# Altium project SAP18.PrjPcb
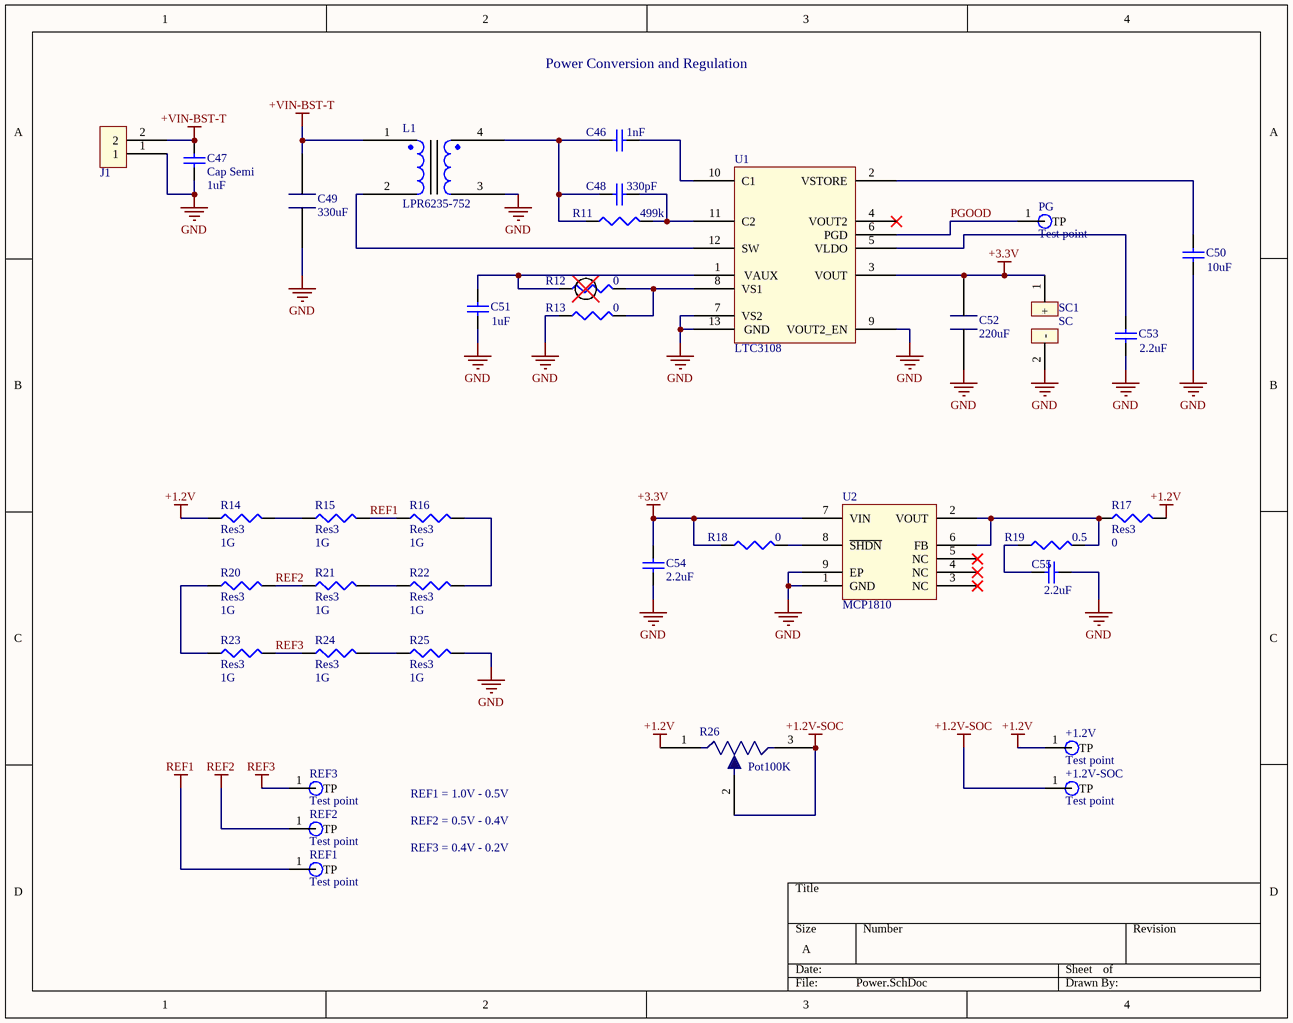
[diagram p0: Power.SchDoc]
8 sheets, 141 parts. Net scope: global (net labels, ports and power ports of the same name join across sheets).
Board file: SAP18.PcbDoc
Sheets:
  Power.SchDoc
  SoC18.SchDoc
  PMU.SchDoc
  Caps.SchDoc
  PwrSel.SchDoc
  Digital.SchDoc
  Analog.SchDoc
  Adapter.SchDoc

## Sheet Power.SchDoc
size A

### Parts
+1.2V  Test point  [TP]
+1.2V-SOC  Test point  [TP]
C46  value 1nF  [0402]  (hidden comment: Cap Semi)
C47  Cap Semi  value 1uF  [0402]
C48  value 330pF  [0402]  (hidden comment: Cap Semi)
C49  330uF  [CAPCP7343X43NEW]
C50  value 10uF  [0402]  (hidden comment: Cap Semi)
C51  value 1uF  [0402]  (hidden comment: Cap Semi)
C52  220uF  [CAPCP7343X43NEW]
C53  value 2.2uF  [0402]  (hidden comment: Cap Semi)
C54  value 2.2uF  [0402]  (hidden comment: Cap Semi)
C55  value 2.2uF  [0402]  (hidden comment: Cap Semi)
J1  MolexPicoLock  [5037630291_MolexPicoLock]  (value not drawn)
L1  LPR6235-752  [LPR6235-752]
PG  Test point  [TP]
R11  value 499k  [0402]  (hidden comment: Res3)
R12  value 0  [0402]  (hidden comment: Res3)
R13  value 0  [0402]  (hidden comment: Res3)
R14  Res3  value 1G  [6-0805_N]
R15  Res3  value 1G  [6-0805_N]
R16  Res3  value 1G  [6-0805_N]
R17  Res3  value 0  [0402]
R18  value 0  [0402]  (hidden comment: Res3)
R19  value 0.5  [0402]  (hidden comment: Res3)
R20  Res3  value 1G  [6-0805_N]
R21  Res3  value 1G  [6-0805_N]
R22  Res3  value 1G  [6-0805_N]
R23  Res3  value 1G  [6-0805_N]
R24  Res3  value 1G  [6-0805_N]
R25  Res3  value 1G  [6-0805_N]
R26  Pot100K  [Pot100K]
REF1  Test point  [TP]
REF2  Test point  [TP]
REF3  Test point  [TP]
SC1  SC  [SocketBattCR2032]
U1  LTC3108  [QFN0P300X400X80_HS-13M]
U2  MCP1810  [MCP1810]

### Nets
+1.2V: +1.2V.1(TP) R14.1 R17.2 R26.1
+1.2V-SOC: +1.2V-SOC.1(TP) R26.2 R26.3  [project net VCAP_STUP]
+3.3V: C52.1 C54.2 R18.1 SC1.1(+) U1.3(VOUT) U2.7(VIN)
+VIN-BST-T: C47.1 C49.1 J1.2 L1.1
GND: C47.2 C49.2 C50.1 C51.1 C52.2 C53.1 C54.1 C55.1 J1.1 L1.3 R13.1 R25.2 SC1.2(-) U1.7(VS2) U1.9(VOUT2_EN) U1.13(GND) U2.1(GND) U2.9(EP)
REF1: R15.2 R16.1 REF1.1(TP)
REF2: R20.2 R21.1 REF2.1(TP)
REF3: R23.2 R24.1 REF3.1(TP)
PGOOD: PG.1(TP) U1.6(PGD)
NetC46_1: C46.1 C48.1 L1.4 R11.1
NetC46_2: C46.2 U1.10(C1)
NetC48_2: C48.2 R11.2 U1.11(C2)
NetC50_2: C50.2 U1.2(VSTORE)
NetC51_2: C51.2 R12.1 U1.1(VAUX)
NetC53_2: C53.2 U1.5(VLDO)
NetC55_2: C55.2 R19.1
NetL1_2: L1.2 U1.12(SW)
NetR12_2: R12.2 R13.2 U1.8(VS1)
NetR14_2: R14.2 R15.1
NetR16_2: R16.2 R22.2
NetR17_1: R17.1 R19.2 U2.2(VOUT) U2.6(FB)
NetR18_2: R18.2 U2.8(~{SHDN})
NetR20_1: R20.1 R23.1
NetR21_2: R21.2 R22.1
NetR24_2: R24.2 R25.1

Not connected (* = marked no-connect by the designer): U1 4(VOUT2)*; U2 3(NC)* 4(NC)* 5(NC)*

### Notes on the sheet
- Power Conversion and Regulation
- REF1 = 1.0V - 0.5V
- REF2 = 0.5V - 0.4V
- REF3 = 0.4V - 0.2V

### Library data of the parts
C46-C48 C50 C51 C53-C55 = Cap Semi: Capacitor (Semiconductor SIM Model); Published: 8-Jun-2000; LatestRevisionDate: 29-May-2009; LatestRevisionNote: IPC-7351 Footprint Added.; PackageReference: C1206; Publisher: Altium Limited; PackageDescription: Chip Capacitor
C49 C52 = BoostCap
J1 = MolexPicoLock: Molex Pico Lock 2 pin
R11-R25 = Res3: Resistor; Published: 8-Jun-2000; LatestRevisionDate: 29-May-2009; LatestRevisionNote: IPC-7351 Footprint Added.; PackageReference: J1-0603; Publisher: Altium Limited; PackageDescription: Chip Resistor
R26 = Pot100K: EVM-2WSX80B15 100K Trimpot SMD
SC1 = Soket Battery CR2032: Socket Battery CR2032
U2 = MCP1810: Ultra-low Power LDO

## Sheet SoC18.SchDoc
size A
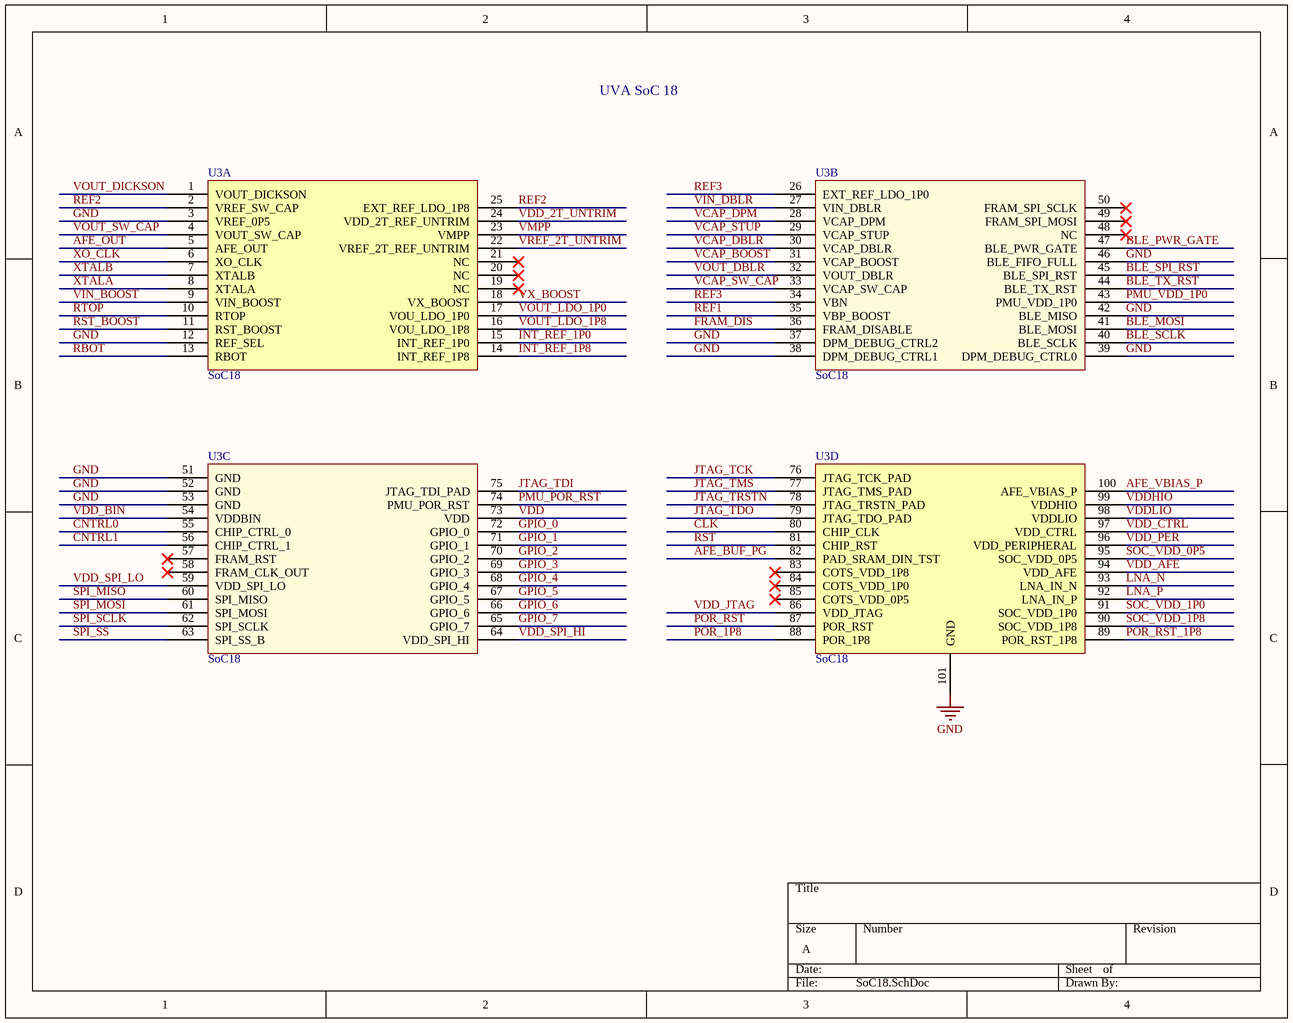
[diagram p1: SoC18.SchDoc]

### Parts
U3  SoC18  [MLF_7009 - NoHoles]  (parts A,B,C,D of 4)

### Nets
AFE_BUF_PG: U3.82(PAD_SRAM_DIN_TST)
FRAM_DIS: U3.36(FRAM_DISABLE)
GND: U3.3(VREF_0P5) U3.12(REF_SEL) U3.28(VCAP_DPM) U3.37(DPM_DEBUG_CTRL2) U3.38(DPM_DEBUG_CTRL1) U3.39(DPM_DEBUG_CTRL0) U3.42(BLE_MISO) U3.46(BLE_FIFO_FULL) U3.51(GND) U3.52(GND) U3.53(GND) U3.101(GND)  [also labelled VCAP_DPM]
PMU_POR_RST: U3.74(PMU_POR_RST)
REF1: U3.35(VBP_BOOST)
REF2: U3.2(VREF_SW_CAP) U3.25(EXT_REF_LDO_1P8)
REF3: U3.26(EXT_REF_LDO_1P0) U3.34(VBN)
SOC_VDD_0P5: U3.95(SOC_VDD_0P5)
SOC_VDD_1P0: U3.91(SOC_VDD_1P0)
SOC_VDD_1P8: U3.90(SOC_VDD_1P8)
VCAP_STUP: U3.29(VCAP_STUP)
VDD: U3.73(VDD)
VDD_AFE: U3.94(VDD_AFE)
VDD_BIN: U3.54(VDDBIN)
VDD_CTRL: U3.97(VDD_CTRL)
VDD_JTAG: U3.86(VDD_JTAG)
VDD_PER: U3.96(VDD_PERIPHERAL)
VDD_SPI_HI: U3.64(VDD_SPI_HI)
VDD_SPI_LO: U3.59(VDD_SPI_LO)
VDDHIO: U3.99(VDDHIO)
VDDLIO: U3.98(VDDLIO)
VOUT_DICKSON: U3.1(VOUT_DICKSON)
AFE_OUT: U3.5(AFE_OUT)
AFE_VBIAS_P: U3.100(AFE_VBIAS_P)
BLE_MOSI: U3.41(BLE_MOSI)
BLE_PWR_GATE: U3.47(BLE_PWR_GATE)
BLE_SCLK: U3.40(BLE_SCLK)
BLE_SPI_RST: U3.45(BLE_SPI_RST)
BLE_TX_RST: U3.44(BLE_TX_RST)
CLK: U3.80(CHIP_CLK)
CNTRL0: U3.55(CHIP_CTRL_0)
CNTRL1: U3.56(CHIP_CTRL_1)
GPIO_0: U3.72(GPIO_0)
GPIO_1: U3.71(GPIO_1)
GPIO_2: U3.70(GPIO_2)
GPIO_3: U3.69(GPIO_3)
GPIO_4: U3.68(GPIO_4)
GPIO_5: U3.67(GPIO_5)
GPIO_6: U3.66(GPIO_6)
GPIO_7: U3.65(GPIO_7)
INT_REF_1P0: U3.15(INT_REF_1P0)
INT_REF_1P8: U3.14(INT_REF_1P8)
JTAG_TCK: U3.76(JTAG_TCK_PAD)
JTAG_TDI: U3.75(JTAG_TDI_PAD)
JTAG_TDO: U3.79(JTAG_TDO_PAD)
JTAG_TMS: U3.77(JTAG_TMS_PAD)
JTAG_TRSTN: U3.78(JTAG_TRSTN_PAD)
LNA_N: U3.93(LNA_IN_N)
LNA_P: U3.92(LNA_IN_P)
PMU_VDD_1P0: U3.43(PMU_VDD_1P0)
POR_1P8: U3.88(POR_1P8)
POR_RST: U3.87(POR_RST)
POR_RST_1P8: U3.89(POR_RST_1P8)
RBOT: U3.13(RBOT)
RST: U3.81(CHIP_RST)
RST_BOOST: U3.11(RST_BOOST)
RTOP: U3.10(RTOP)
SPI_MISO: U3.60(SPI_MISO)
SPI_MOSI: U3.61(SPI_MOSI)
SPI_SCLK: U3.62(SPI_SCLK)
SPI_SS: U3.63(SPI_SS_B)
VCAP_BOOST: U3.31(VCAP_BOOST)
VCAP_DBLR: U3.30(VCAP_DBLR)
VCAP_SW_CAP: U3.33(VCAP_SW_CAP)
VDD_2T_UNTRIM: U3.24(VDD_2T_REF_UNTRIM)
VIN_BOOST: U3.9(VIN_BOOST)
VIN_DBLR: U3.27(VIN_DBLR)
VMPP: U3.23(VMPP)
VOUT_DBLR: U3.32(VOUT_DBLR)
VOUT_LDO_1P0: U3.17(VOU_LDO_1P0)
VOUT_LDO_1P8: U3.16(VOU_LDO_1P8)
VOUT_SW_CAP: U3.4(VOUT_SW_CAP)
VREF_2T_UNTRIM: U3.22(VREF_2T_REF_UNTRIM)
VX_BOOST: U3.18(VX_BOOST)
XO_CLK: U3.6(XO_CLK)
XTALA: U3.8(XTALA)
XTALB: U3.7(XTALB)

Not connected (* = marked no-connect by the designer): U3 19(NC)* 20(NC)* 21(NC)* 48(NC)* 49(FRAM_SPI_MOSI)* 50(FRAM_SPI_SCLK)* 57(FRAM_RST)* 58(FRAM_CLK_OUT)* 83(COTS_VDD_1P8)* 84(COTS_VDD_1P0)* 85(COTS_VDD_0P5)*

### Notes on the sheet
- UVA SoC 18

### Library data of the parts
U3 = SoC18: UVA SoC ASSIST 2018

## Sheet PMU.SchDoc
size A
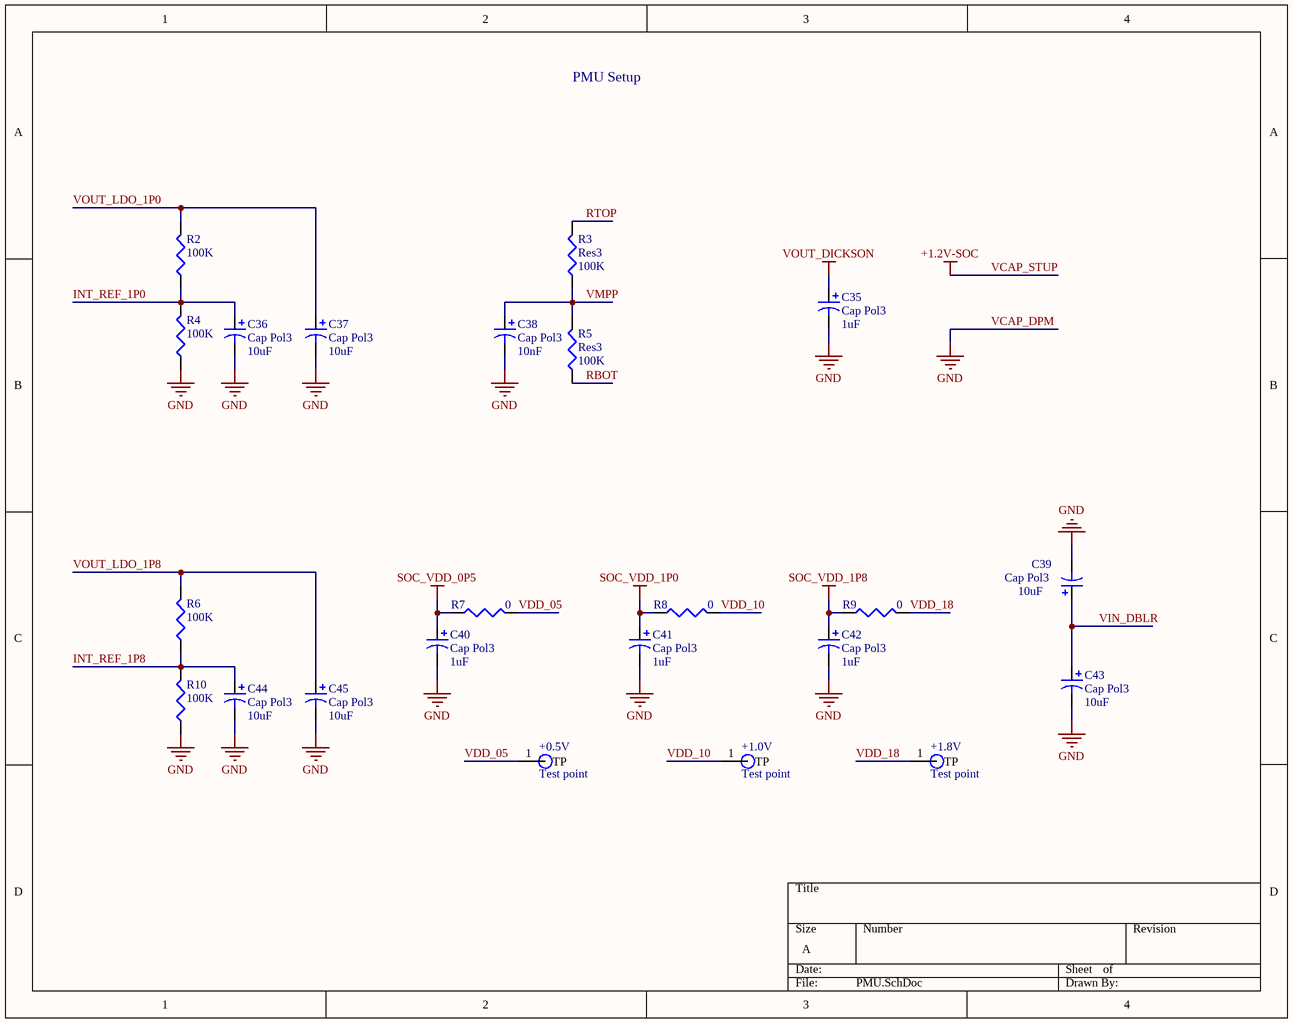
[diagram p2: PMU.SchDoc]

### Parts
+0.5V  Test point  [TP]
+1.0V  Test point  [TP]
+1.8V  Test point  [TP]
C35  Cap Pol3  value 1uF  [0402]
C36  Cap Pol3  value 10uF  [0402]
C37  Cap Pol3  value 10uF  [0402]
C38  Cap Pol3  value 10nF  [0402]
C39  Cap Pol3  value 10uF  [0402]
C40  Cap Pol3  value 1uF  [0402]
C41  Cap Pol3  value 1uF  [0402]
C42  Cap Pol3  value 1uF  [0402]
C43  Cap Pol3  value 10uF  [0402]
C44  Cap Pol3  value 10uF  [0402]
C45  Cap Pol3  value 10uF  [0402]
R2  value 100K  [0402]  (hidden comment: Res3)
R3  Res3  value 100K  [0402]
R4  value 100K  [0402]  (hidden comment: Res3)
R5  Res3  value 100K  [0402]
R6  value 100K  [0402]  (hidden comment: Res3)
R7  value 0  [0402]  (hidden comment: Res3)
R8  value 0  [0402]  (hidden comment: Res3)
R9  value 0  [0402]  (hidden comment: Res3)
R10  value 100K  [0402]  (hidden comment: Res3)

### Nets
GND: C35.2 C36.2 C37.2 C38.2 C39.2 C40.2 C41.2 C42.2 C43.2 C44.2 C45.2 R4.1 R10.1  [also labelled VCAP_DPM]
SOC_VDD_0P5: C40.1 R7.1
SOC_VDD_1P0: C41.1 R8.1
SOC_VDD_1P8: C42.1 R9.1
VDD_05: +0.5V.1(TP) R7.2
VDD_10: +1.0V.1(TP) R8.2
VDD_18: +1.8V.1(TP) R9.2
VOUT_DICKSON: C35.1
INT_REF_1P0: C36.1 R2.1 R4.2
INT_REF_1P8: C44.1 R6.1 R10.2
RBOT: R5.1
RTOP: R3.2
VIN_DBLR: C39.1 C43.1
VMPP: C38.1 R3.1 R5.2
VOUT_LDO_1P0: C37.1 R2.2
VOUT_LDO_1P8: C45.1 R6.2

### Notes on the sheet
- PMU Setup

### Library data of the parts
C35-C45 = Cap Pol3: Polarized Capacitor (Surface Mount); Published: 8-Jun-2000; LatestRevisionDate: 29-May-2009; LatestRevisionNote: IPC-7351 Footprint Added.; PackageReference: C0805; Publisher: Altium Limited; PackageDescription: Chip Capacitor
R2-R10 = Res3: Resistor; Published: 8-Jun-2000; LatestRevisionDate: 29-May-2009; LatestRevisionNote: IPC-7351 Footprint Added.; PackageReference: J1-0603; Publisher: Altium Limited; PackageDescription: Chip Resistor

## Sheet Caps.SchDoc
size A
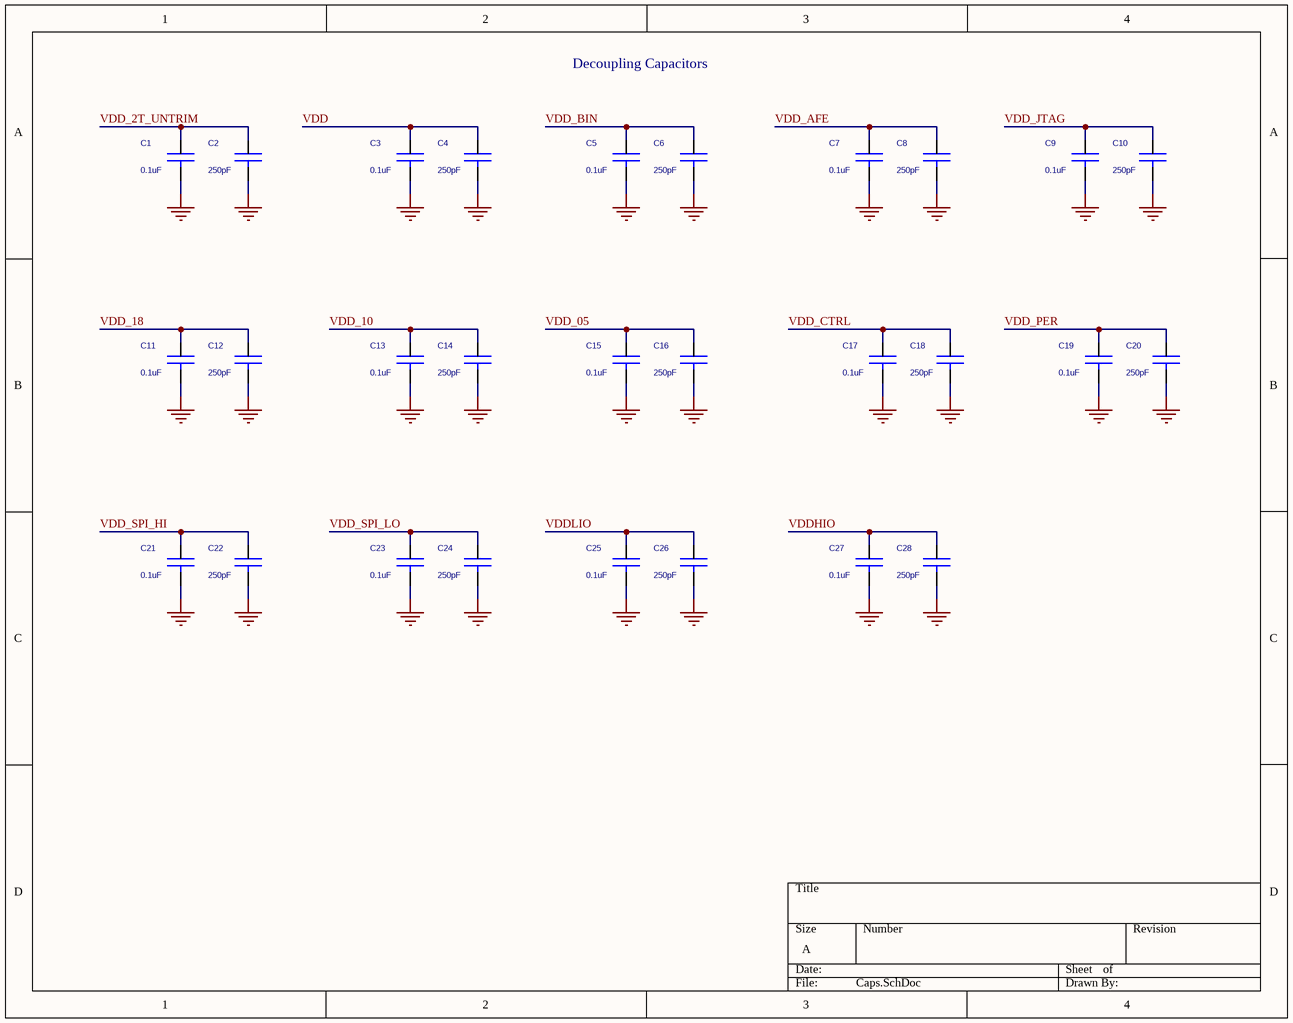
[diagram p3: Caps.SchDoc]

### Parts
C1  0.1uF  [0402]
C2  250pF  [0402]
C3  0.1uF  [0402]
C4  250pF  [0402]
C5  0.1uF  [0402]
C6  250pF  [0402]
C7  0.1uF  [0402]
C8  250pF  [0402]
C9  0.1uF  [0402]
C10  250pF  [0402]
C11  0.1uF  [0402]
C12  250pF  [0402]
C13  0.1uF  [0402]
C14  250pF  [0402]
C15  0.1uF  [0402]
C16  250pF  [0402]
C17  0.1uF  [0402]
C18  250pF  [0402]
C19  0.1uF  [0402]
C20  250pF  [0402]
C21  0.1uF  [0402]
C22  250pF  [0402]
C23  0.1uF  [0402]
C24  250pF  [0402]
C25  0.1uF  [0402]
C26  250pF  [0402]
C27  0.1uF  [0402]
C28  250pF  [0402]

### Nets
GND: C1.2 C2.2 C3.2 C4.2 C5.2 C6.2 C7.2 C8.2 C9.2 C10.2 C11.2 C12.2 C13.2 C14.2 C15.2 C16.2 C17.2 C18.2 C19.2 C20.2 C21.2 C22.2 C23.2 C24.2 C25.2 C26.2 C27.2 C28.2
VDD: C3.1 C4.1
VDD_05: C15.1 C16.1
VDD_10: C13.1 C14.1
VDD_18: C11.1 C12.1
VDD_AFE: C7.1 C8.1
VDD_BIN: C5.1 C6.1
VDD_CTRL: C17.1 C18.1
VDD_JTAG: C9.1 C10.1
VDD_PER: C19.1 C20.1
VDD_SPI_HI: C21.1 C22.1
VDD_SPI_LO: C23.1 C24.1
VDDHIO: C27.1 C28.1
VDDLIO: C25.1 C26.1
VDD_2T_UNTRIM: C1.1 C2.1

### Notes on the sheet
- Decoupling Capacitors

### Library data of the parts
C1-C28 = C

## Sheet PwrSel.SchDoc
size A
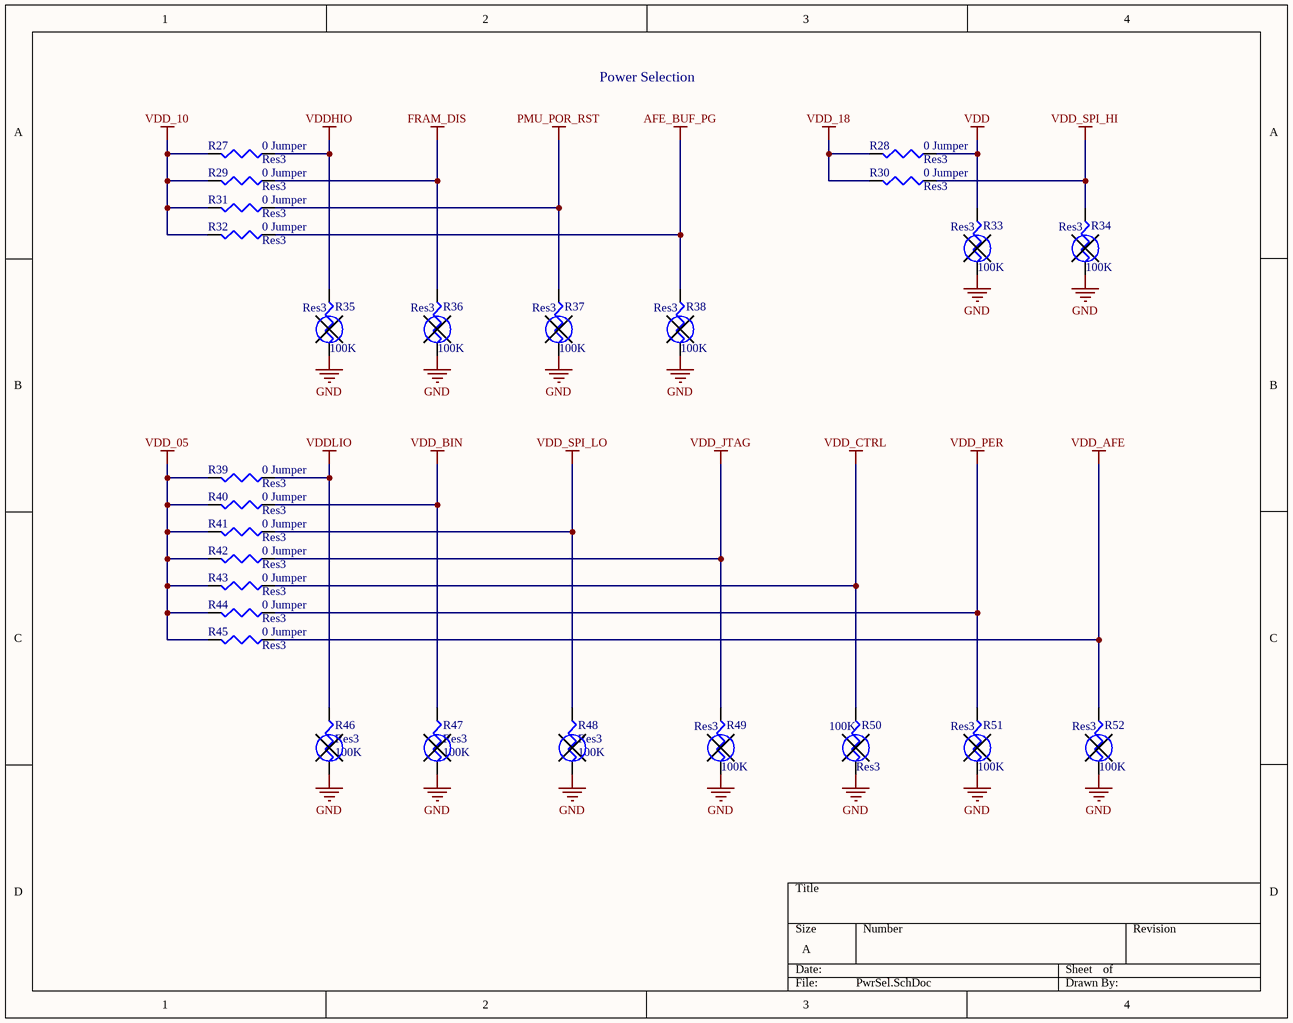
[diagram p4: PwrSel.SchDoc]

### Parts
R27  Res3  value 0 Jumper  [0402]
R28  Res3  value 0 Jumper  [0402]
R29  Res3  value 0 Jumper  [0402]
R30  Res3  value 0 Jumper  [0402]
R31  Res3  value 0 Jumper  [0402]
R32  Res3  value 0 Jumper  [0402]
R33  Res3  value 100K  [0402]
R34  Res3  value 100K  [0402]
R35  Res3  value 100K  [0402]
R36  Res3  value 100K  [0402]
R37  Res3  value 100K  [0402]
R38  Res3  value 100K  [0402]
R39  Res3  value 0 Jumper  [0402]
R40  Res3  value 0 Jumper  [0402]
R41  Res3  value 0 Jumper  [0402]
R42  Res3  value 0 Jumper  [0402]
R43  Res3  value 0 Jumper  [0402]
R44  Res3  value 0 Jumper  [0402]
R45  Res3  value 0 Jumper  [0402]
R46  Res3  value 100K  [0402]
R47  Res3  value 100K  [0402]
R48  Res3  value 100K  [0402]
R49  Res3  value 100K  [0402]
R50  Res3  value 100K  [0402]
R51  Res3  value 100K  [0402]
R52  Res3  value 100K  [0402]

### Nets
AFE_BUF_PG: R32.1 R38.1
FRAM_DIS: R29.1 R36.1
GND: R33.2 R34.2 R35.2 R36.2 R37.2 R38.2 R46.2 R47.2 R48.2 R49.2 R50.2 R51.2 R52.2
PMU_POR_RST: R31.1 R37.1
VDD: R28.1 R33.1
VDD_05: R39.2 R40.2 R41.2 R42.2 R43.2 R44.2 R45.2
VDD_10: R27.2 R29.2 R31.2 R32.2
VDD_18: R28.2 R30.2
VDD_AFE: R45.1 R52.1
VDD_BIN: R40.1 R47.1
VDD_CTRL: R43.1 R50.1
VDD_JTAG: R42.1 R49.1
VDD_PER: R44.1 R51.1
VDD_SPI_HI: R30.1 R34.1
VDD_SPI_LO: R41.1 R48.1
VDDHIO: R27.1 R35.1
VDDLIO: R39.1 R46.1

### Notes on the sheet
- Power Selection

### Library data of the parts
R27-R52 = Res3: Resistor; Published: 8-Jun-2000; LatestRevisionDate: 29-May-2009; LatestRevisionNote: IPC-7351 Footprint Added.; PackageReference: J1-0603; Publisher: Altium Limited; PackageDescription: Chip Resistor

## Sheet Digital.SchDoc
size A
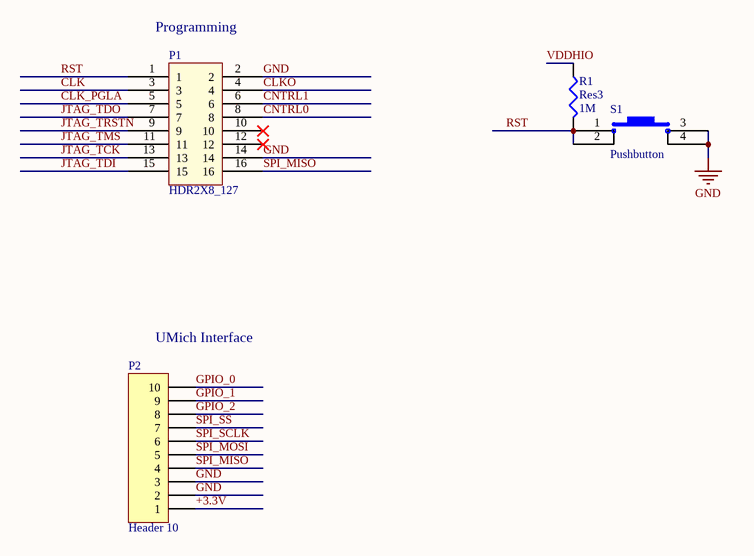
[diagram p5: Digital.SchDoc]

### Parts
P1  HDR2X8_127  [HDR2X8_127]
P2  Header 10  [505110-1092]
R1  Res3  value 1M  [0402]
S1  Pushbutton  [KMT031]

### Nets
+3.3V: P2.1
GND: P1.2 P1.14 P2.2 P2.3 S1.3 S1.4
VDDHIO: R1.1
CLK: P1.3
CLK_PGLA: P1.5
CLKO: P1.4
CNTRL0: P1.8
CNTRL1: P1.6
GPIO_0: P2.10
GPIO_1: P2.9
GPIO_2: P2.8
JTAG_TCK: P1.13
JTAG_TDI: P1.15
JTAG_TDO: P1.7
JTAG_TMS: P1.11
JTAG_TRSTN: P1.9
RST: P1.1 R1.2 S1.1 S1.2
SPI_MISO: P1.16 P2.4
SPI_MOSI: P2.5
SPI_SCLK: P2.6
SPI_SS: P2.7

Not connected (* = marked no-connect by the designer): P1 10* 12*

### Notes on the sheet
- (near P1) Programming
- (near P2) UMich Interface

### Library data of the parts
P1 = HDR2X8_127: Header 16 positions 1.27mm
P2 = Header 10: Header, 10-Pin; LatestRevisionDate: 17-Jul-2002; LatestRevisionNote: Re-released for DXP Platform.; Publisher: Altium Limited
R1 = Res3: Resistor; Published: 8-Jun-2000; LatestRevisionDate: 29-May-2009; LatestRevisionNote: IPC-7351 Footprint Added.; PackageReference: J1-0603; Publisher: Altium Limited; PackageDescription: Chip Resistor
S1 = PB_SW: Pushbutton, 4 leads

## Sheet Analog.SchDoc
size A
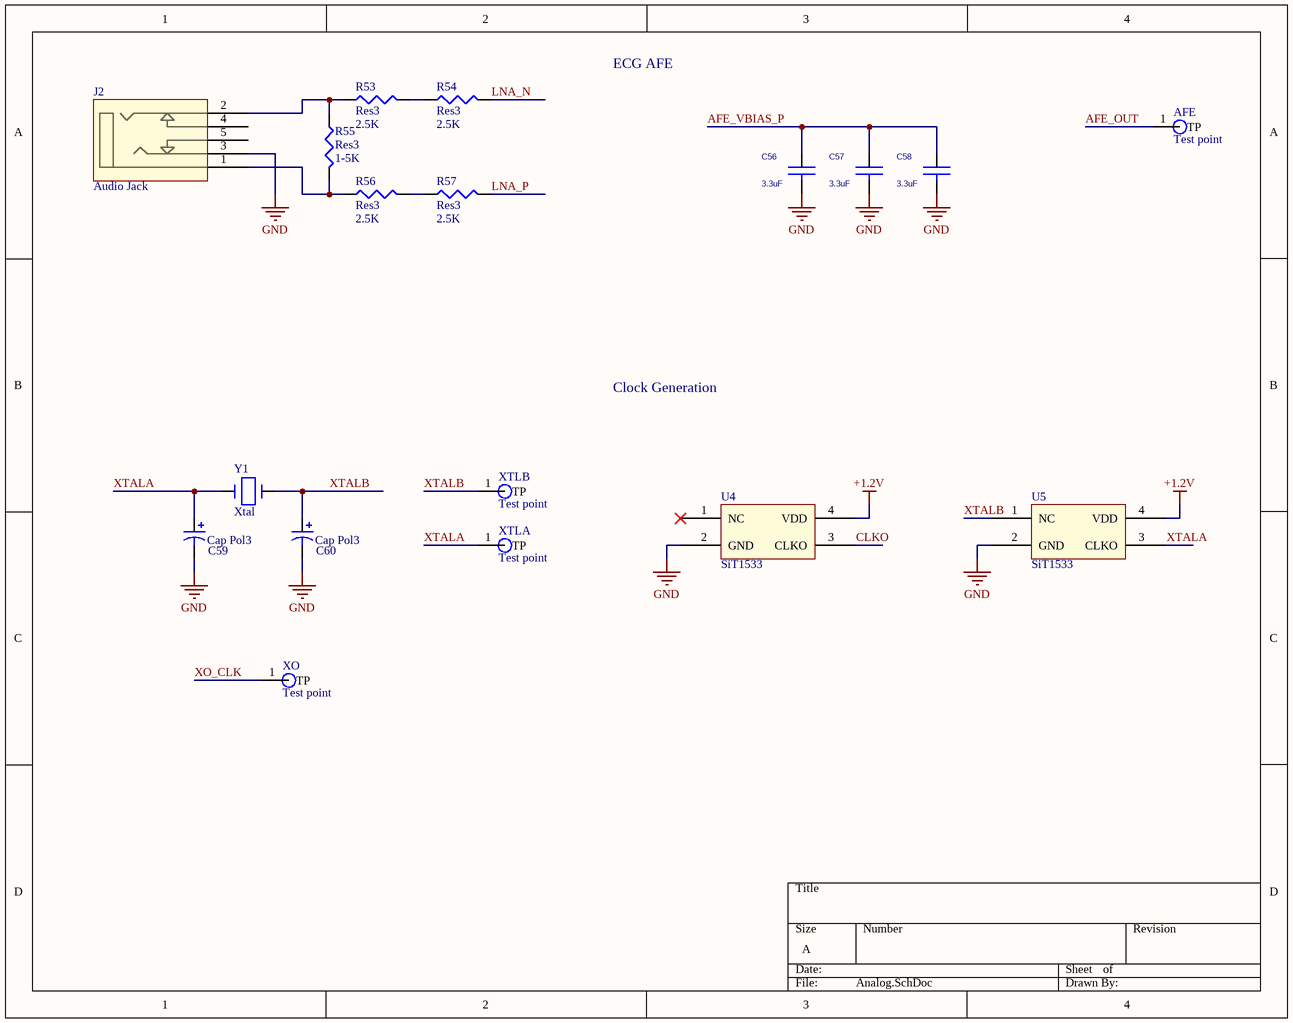
[diagram p6: Analog.SchDoc]

### Parts
AFE  Test point  [TP]
C56  3.3uF  [0402]
C57  3.3uF  [0402]
C58  3.3uF  [0402]
C59  Cap Pol3  [0402]
C60  Cap Pol3  [0402]
J2  Audio Jack  [Audio Jack]
R53  Res3  value 2.5K  [0402]
R54  Res3  value 2.5K  [0402]
R55  Res3  value 1-5K  [0402]
R56  Res3  value 2.5K  [0402]
R57  Res3  value 2.5K  [0402]
U4  SiT1533  [SiT1533]
U5  SiT1533  [SiT1533]
XO  Test point  [TP]
XTLA  Test point  [TP]
XTLB  Test point  [TP]
Y1  Xtal  [Xtal_C2]

### Nets
+1.2V: U4.4(VDD) U5.4(VDD)
GND: C56.2 C57.2 C58.2 C59.2 C60.2 J2.3 U4.2(GND) U5.2(GND)
AFE_OUT: AFE.1(TP)
AFE_VBIAS_P: C56.1 C57.1 C58.1
CLKO: U4.3(CLKO)
LNA_N: R54.2
LNA_P: R57.2
XO_CLK: XO.1(TP)
XTALA: C59.1 U5.3(CLKO) XTLA.1(TP) Y1.1
XTALB: C60.1 U5.1(NC) XTLB.1(TP) Y1.2
NetJ2_1: J2.1 R55.2 R56.1
NetJ2_2: J2.2 R53.1 R55.1
NetR53_2: R53.2 R54.1
NetR56_2: R56.2 R57.1

Not connected (* = marked no-connect by the designer): J2 4 5; U4 1(NC)*

### Notes on the sheet
- ECG AFE
- Clock Generation

### Library data of the parts
C56-C58 = C
C59 C60 = Cap Pol3: Polarized Capacitor (Surface Mount); Published: 8-Jun-2000; LatestRevisionDate: 29-May-2009; LatestRevisionNote: IPC-7351 Footprint Added.; PackageReference: C0805; Publisher: Altium Limited; PackageDescription: Chip Capacitor
R53-R57 = Res3: Resistor; Published: 8-Jun-2000; LatestRevisionDate: 29-May-2009; LatestRevisionNote: IPC-7351 Footprint Added.; PackageReference: J1-0603; Publisher: Altium Limited; PackageDescription: Chip Resistor
U4 U5 = SiT1533: Ultra-low Power 32KHz Oscillator

## Sheet Adapter.SchDoc
size A
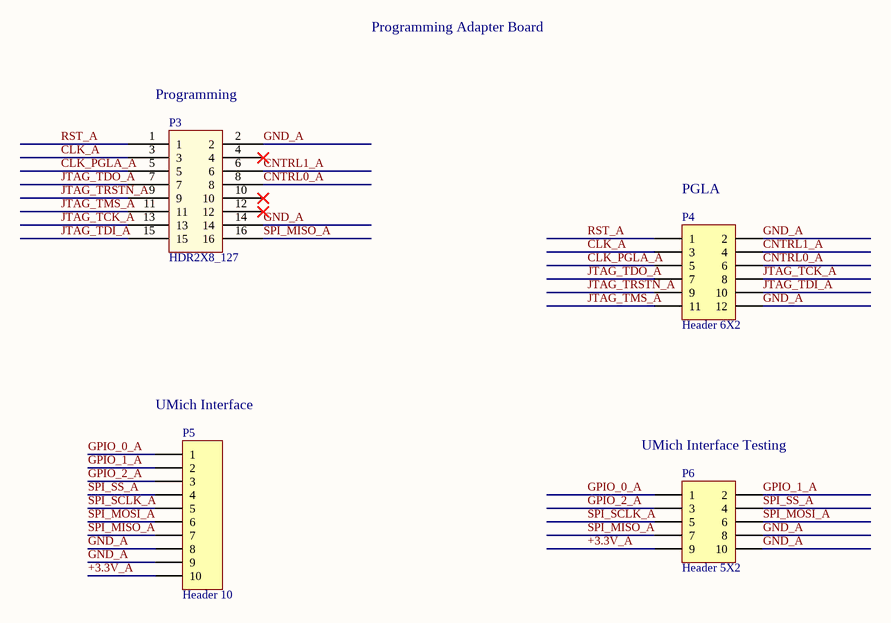
[diagram p7: Adapter.SchDoc]

### Parts
P3  HDR2X8_127  [HDR2X8_127]
P4  Header 6X2  [HDR2X6]
P5  Header 10  [505110-1092]
P6  Header 5X2  [HDR2X5]

### Nets
+3.3V_A: P5.10 P6.9
CLK_A: P3.3 P4.3
CLK_PGLA_A: P3.5 P4.5
CNTRL0_A: P3.8 P4.6
CNTRL1_A: P3.6 P4.4
GND_A: P3.2 P3.14 P4.2 P4.12 P5.8 P5.9 P6.8 P6.10
GPIO_0_A: P5.1 P6.1
GPIO_1_A: P5.2 P6.2
GPIO_2_A: P5.3 P6.3
JTAG_TCK_A: P3.13 P4.8
JTAG_TDI_A: P3.15 P4.10
JTAG_TDO_A: P3.7 P4.7
JTAG_TMS_A: P3.11 P4.11
JTAG_TRSTN_A: P3.9 P4.9
RST_A: P3.1 P4.1
SPI_MISO_A: P3.16 P5.7 P6.7
SPI_MOSI_A: P5.6 P6.6
SPI_SCLK_A: P5.5 P6.5
SPI_SS_A: P5.4 P6.4

Not connected (* = marked no-connect by the designer): P3 4* 10* 12*

### Notes on the sheet
- Programming Adapter Board
- (near P3) Programming
- (near P4) PGLA
- (near P5) UMich Interface
- (near P6) UMich Interface Testing

### Library data of the parts
P3 = HDR2X8_127: Header 16 positions 1.27mm
P4 = Header 6X2: Header, 6-Pin, Dual row; LatestRevisionDate: 17-Jul-2002; LatestRevisionNote: Re-released for DXP Platform.; Publisher: Altium Limited
P5 = Header 10: Header, 10-Pin; LatestRevisionDate: 17-Jul-2002; LatestRevisionNote: Re-released for DXP Platform.; Publisher: Altium Limited
P6 = Header 5X2: Header, 5-Pin, Dual row; LatestRevisionDate: 17-Jul-2002; LatestRevisionNote: Re-released for DXP Platform.; Publisher: Altium Limited

## Nets that join several sheets
+1.2V: Power (+1.2V.1 R14.1 R17.2 R26.1), Analog (U4.4 U5.4)
+3.3V: Power (6 pins), Digital (P2.1)
AFE_BUF_PG: SoC18 (U3.82), PwrSel (R32.1 R38.1)
FRAM_DIS: SoC18 (U3.36), PwrSel (R29.1 R36.1)
GND: Power (18 pins), SoC18 (12 pins), PMU (13 pins), Caps (28 pins), PwrSel (13 pins), Digital (6 pins), Analog (8 pins)
PMU_POR_RST: SoC18 (U3.74), PwrSel (R31.1 R37.1)
REF1: Power (R15.2 R16.1 REF1.1), SoC18 (U3.35)
REF2: Power (R20.2 R21.1 REF2.1), SoC18 (U3.2 U3.25)
REF3: Power (R23.2 R24.1 REF3.1), SoC18 (U3.26 U3.34)
SOC_VDD_0P5: SoC18 (U3.95), PMU (C40.1 R7.1)
SOC_VDD_1P0: SoC18 (U3.91), PMU (C41.1 R8.1)
SOC_VDD_1P8: SoC18 (U3.90), PMU (C42.1 R9.1)
VCAP_STUP: Power (+1.2V-SOC.1 R26.2 R26.3), SoC18 (U3.29)
VDD: SoC18 (U3.73), Caps (C3.1 C4.1), PwrSel (R28.1 R33.1)
VDD_05: PMU (+0.5V.1 R7.2), Caps (C15.1 C16.1), PwrSel (7 pins)
VDD_10: PMU (+1.0V.1 R8.2), Caps (C13.1 C14.1), PwrSel (R27.2 R29.2 R31.2 R32.2)
VDD_18: PMU (+1.8V.1 R9.2), Caps (C11.1 C12.1), PwrSel (R28.2 R30.2)
VDD_AFE: SoC18 (U3.94), Caps (C7.1 C8.1), PwrSel (R45.1 R52.1)
VDD_BIN: SoC18 (U3.54), Caps (C5.1 C6.1), PwrSel (R40.1 R47.1)
VDD_CTRL: SoC18 (U3.97), Caps (C17.1 C18.1), PwrSel (R43.1 R50.1)
VDD_JTAG: SoC18 (U3.86), Caps (C9.1 C10.1), PwrSel (R42.1 R49.1)
VDD_PER: SoC18 (U3.96), Caps (C19.1 C20.1), PwrSel (R44.1 R51.1)
VDD_SPI_HI: SoC18 (U3.64), Caps (C21.1 C22.1), PwrSel (R30.1 R34.1)
VDD_SPI_LO: SoC18 (U3.59), Caps (C23.1 C24.1), PwrSel (R41.1 R48.1)
VDDHIO: SoC18 (U3.99), Caps (C27.1 C28.1), PwrSel (R27.1 R35.1), Digital (R1.1)
VDDLIO: SoC18 (U3.98), Caps (C25.1 C26.1), PwrSel (R39.1 R46.1)
VOUT_DICKSON: SoC18 (U3.1), PMU (C35.1)
AFE_OUT: SoC18 (U3.5), Analog (AFE.1)
AFE_VBIAS_P: SoC18 (U3.100), Analog (C56.1 C57.1 C58.1)
CLK: SoC18 (U3.80), Digital (P1.3)
CLKO: Digital (P1.4), Analog (U4.3)
CNTRL0: SoC18 (U3.55), Digital (P1.8)
CNTRL1: SoC18 (U3.56), Digital (P1.6)
GPIO_0: SoC18 (U3.72), Digital (P2.10)
GPIO_1: SoC18 (U3.71), Digital (P2.9)
GPIO_2: SoC18 (U3.70), Digital (P2.8)
INT_REF_1P0: SoC18 (U3.15), PMU (C36.1 R2.1 R4.2)
INT_REF_1P8: SoC18 (U3.14), PMU (C44.1 R6.1 R10.2)
JTAG_TCK: SoC18 (U3.76), Digital (P1.13)
JTAG_TDI: SoC18 (U3.75), Digital (P1.15)
JTAG_TDO: SoC18 (U3.79), Digital (P1.7)
JTAG_TMS: SoC18 (U3.77), Digital (P1.11)
JTAG_TRSTN: SoC18 (U3.78), Digital (P1.9)
LNA_N: SoC18 (U3.93), Analog (R54.2)
LNA_P: SoC18 (U3.92), Analog (R57.2)
RBOT: SoC18 (U3.13), PMU (R5.1)
RST: SoC18 (U3.81), Digital (P1.1 R1.2 S1.1 S1.2)
RTOP: SoC18 (U3.10), PMU (R3.2)
SPI_MISO: SoC18 (U3.60), Digital (P1.16 P2.4)
SPI_MOSI: SoC18 (U3.61), Digital (P2.5)
SPI_SCLK: SoC18 (U3.62), Digital (P2.6)
SPI_SS: SoC18 (U3.63), Digital (P2.7)
VDD_2T_UNTRIM: SoC18 (U3.24), Caps (C1.1 C2.1)
VIN_DBLR: SoC18 (U3.27), PMU (C39.1 C43.1)
VMPP: SoC18 (U3.23), PMU (C38.1 R3.1 R5.2)
VOUT_LDO_1P0: SoC18 (U3.17), PMU (C37.1 R2.2)
VOUT_LDO_1P8: SoC18 (U3.16), PMU (C45.1 R6.2)
XO_CLK: SoC18 (U3.6), Analog (XO.1)
XTALA: SoC18 (U3.8), Analog (C59.1 U5.3 XTLA.1 Y1.1)
XTALB: SoC18 (U3.7), Analog (C60.1 U5.1 XTLB.1 Y1.2)